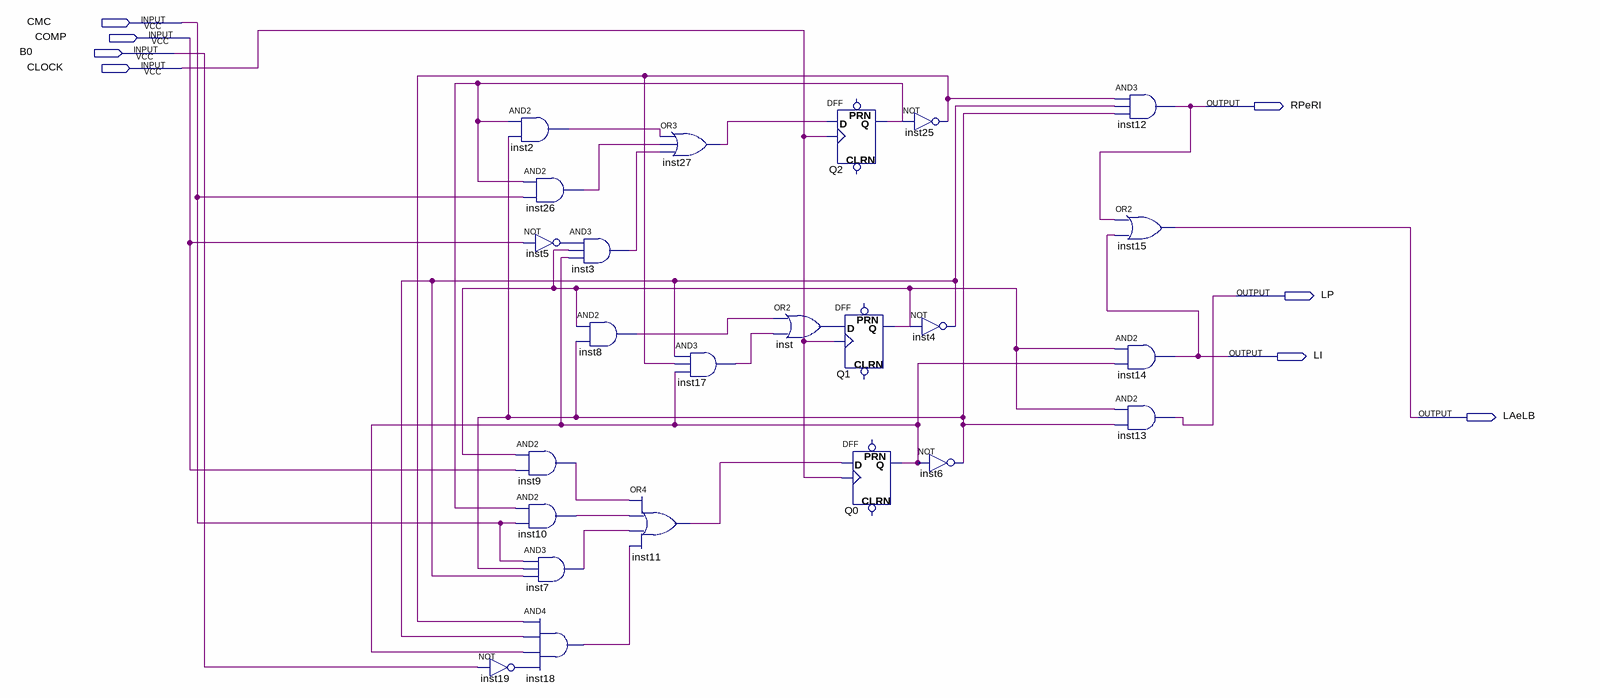
[diagram p0: schematic sheet]
// Quartus schematic BlocodControle.bdf as structural Verilog: 24 symbols, 8 pins
module BlocodControle (
  input  CMC,
  input  COMP,
  input  B0,
  input  CLOCK,
  output RPeRI,
  output LP,
  output LI,
  output LAeLB
);

  wire inst2_out, inst3_out, inst4_out, inst5_out, inst6_out, inst7_out, inst8_out, inst9_out, inst10_out,
       inst11_out, inst17_out, inst18_out, inst19_out, inst25_out, inst26_out, inst27_out, inst_out, Q0_q,
       Q1_q, Q2_q;

  and inst2 (inst2_out, Q2_q, inst6_out);
  and inst26 (inst26_out, Q2_q, CMC);
  not inst5 (inst5_out, COMP);
  and inst9 (inst9_out, Q1_q, COMP);
  and inst10 (inst10_out, Q2_q, CMC);
  and inst7 (inst7_out, CMC, inst6_out, inst4_out);
  and inst18 (inst18_out, inst25_out, inst4_out, Q0_q, inst19_out);
  not inst19 (inst19_out, B0);
  and inst3 (inst3_out, inst5_out, Q1_q, Q0_q);
  and inst8 (inst8_out, Q1_q, inst6_out);
  or inst11 (inst11_out, inst9_out, inst10_out, inst7_out, inst18_out);
  or inst27 (inst27_out, inst2_out, inst26_out, inst3_out);
  and inst17 (inst17_out, inst4_out, inst25_out, Q0_q);
  DFF Q2 (.CLK(CLOCK), .D(inst27_out), .Q(Q2_q));  // open: CLRN, PRN
  or inst (inst_out, inst8_out, inst17_out);
  DFF Q1 (.CLK(CLOCK), .D(inst_out), .Q(Q1_q));  // open: CLRN, PRN
  DFF Q0 (.CLK(CLOCK), .D(inst11_out), .Q(Q0_q));  // open: CLRN, PRN
  not inst25 (inst25_out, Q2_q);
  not inst4 (inst4_out, Q1_q);
  not inst6 (inst6_out, Q0_q);
  and inst12 (RPeRI, inst25_out, inst4_out, inst6_out);
  or inst15 (LAeLB, RPeRI, LI);
  and inst14 (LI, Q1_q, Q0_q);
  and inst13 (LP, Q1_q, inst6_out);
endmodule
